# Altium schematic sheet CC-S04-V00-RS232.SchDoc
size A3
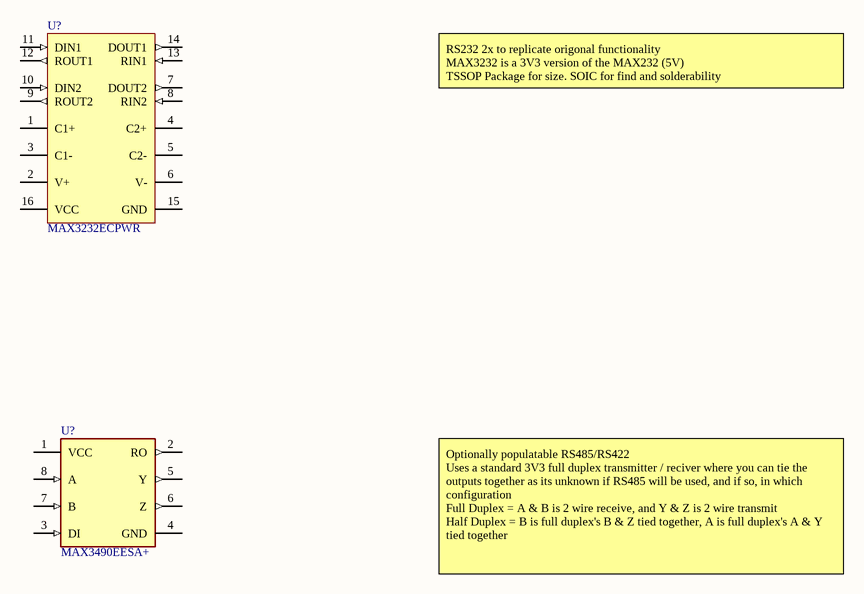
[diagram p0: CC-S04-V00-RS232.SchDoc]

## Parts
(Parts that share a designator on the sheet are numbered #1, #2 ... from top to bottom, then left to right.)
U?#1  MAX3232ECPWR  [PW0016A_M]
U?#2  MAX3490EESA+  [FP-S8-5-MFG]

## Nets

Not connected (* = marked no-connect by the designer): U?#1 1(C1+) 2(V+) 3(C1-) 4(C2+) 5(C2-) 6(V-) 7(DOUT2) 8(RIN2) 9(ROUT2) 10(DIN2) 11(DIN1) 12(ROUT1) 13(RIN1) 14(DOUT1) 15(GND) 16(VCC); U?#2 1(VCC) 2(RO) 3(DI) 4(GND) 5(Y) 6(Z) 7(B) 8(A)

## Notes on the sheet
- RS232 2x to replicate origonal functionality
  MAX3232 is a 3V3 version of the MAX232 (5V)
  TSSOP Package for size. SOIC for find and solderability
- Optionally populatable RS485/RS422
  Uses a standard 3V3 full duplex transmitter / reciver where you can tie the outputs together as its unknown if RS485 will be used, and if so, in which configuration
  Full Duplex = A & B is 2 wire receive, and Y & Z is 2 wire transmit
  Half Duplex = B is full duplex's B & Z tied together, A is full duplex's A & Y tied together
- Revision History:
- Sheet Title:
- Rev
- Date
- Description
- Project:
- Size:
- Drawn By:
- A3
- Number:
- Revision:
- Sheet
- Version:
- of
- QUT Motorsport
- O-120, Gardens Point
- 2 George Street
- Brisbane, QLD 4000
- Australia
- Print Date:
- Print Time:
- File Name:

## Library data of the parts
U?#1 = CMP-0299-01479-2: 3-V to 5.5-V Multichannel RS-232 Line Driver / Receiver with ±15-kV IEC ESD Protection, 0 to 70 degC, 16-Pin TSSOP (PW), Green (RoHS & no Sb/Br); Supply Voltage(s)(V): 3.3 or 5.0; Receivers Per Package: 2; ESD HBM(kV): +/-15; IEC-61000-4-2 SUPPORT: TRUE; ICC(Max)(mA): 1; ComponentLink2Description: Datasheet; PackageVersion: revG, Feb-2011; ComponentLink3Description: Package Specification; DatasheetVersion: SLLS664A; Drivers Per Package: 2; PackageDescription: 16-Pin Plastic Thin Small Outline Package 5 x 4.4 mm Body ,0.65 mm Pitch; ComponentLink3URL: http://www.ti.com/litv/pdf/mpds361; ComponentLink1Description: Manufacturer URL; ComponentLink2URL: http://www.ti.com/general/docs/lit/getliterature.tsp?genericPartNumber=MAX3232E&fileType=pdf; PackageReference: PW0016A; RS-232: TRUE; SubFamily: RS-232; Single Supply: TRUE; ComponentLink1URL: www.ti.com
U?#2 = CMP-05679-000028-1: IC TRANSCEIVER FULL 1/1 8SOIC; Manufacturer: Maxim Integrated; Nominal Supply Current: 0.95-1.1mA; Description: 1/1 Transceiver Full RS422, RS485 8-SOIC; Simplex Duplex: Full Duplex; Min Supply Voltage: 3V; Standoff Height: 0.1mm; Number Of Transmitters: 1; Interface: RS-485,RS-422; Max Junction Temp: +150°C; Data Rate: 12Mbits/s; Max Supply Voltage: 3.6V; Device Class L1: Integrated Circuits (ICs); ComponentLink2URL: https://datasheets.maximintegrated.com/en/ds/MAX3483E-MAX3491E.pdf; Temperature Range High: +85°C; Package: S8-5; RoHS: TRUE; Mouser Description: RS-422/RS-485 Interface IC 3.3V 12Mbps Transceiver; Temperature: -40°C to +85°C; Device Class L2: Interface ICs; Category: IC; ComponentLink2Description: Datasheet; Footprint Url: https://pdfserv.maximintegrated.com/land_patterns/90-0096.PDF; Automotive: No; Temperature Range Low: -40°C; Manufacturer Part Number: MAX3490EESA+; Octopart: https://octopart.com/max3490eesa%2B-maxim+integrated-39731905; Height: 1.75mm; Digikey Description: IC TRANSCEIVER FULL 1/1 8SOIC; Lead Free: Yes; Number Of Receivers: 1; Device Class L3: RS-232 / RS-422 / RS-485 Interface ICs